# Altium schematic sheet rs485.SchDoc
size A4; SheetNumber: 4; SheetTotal: 4
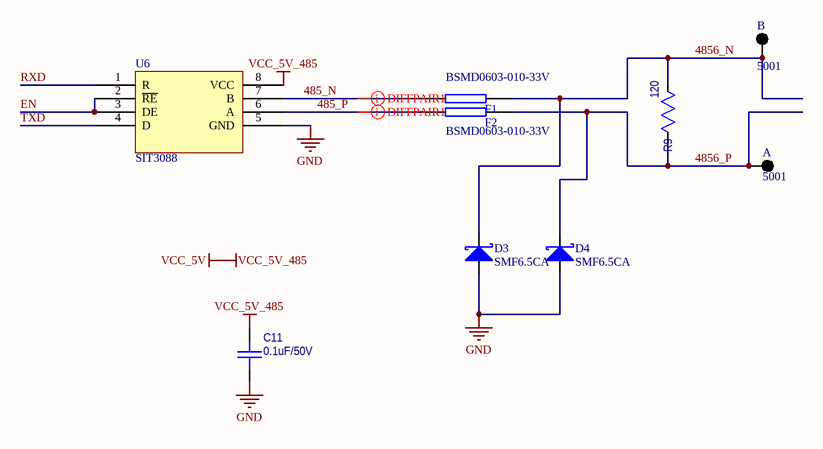
[diagram p0: rs485.SchDoc]

## Parts
A  5001  [KSTN-5001]  (no BOM)
B  5001  [KSTN-5001]  (no BOM)
C11  0.1uF/50V  [CAPC1608X092N_0603]
D3  SMF6.5CA  [SOD123]
D4  SMF6.5CA  [SOD123]
F1  BSMD0603-010-33V  [0603R]
F2  BSMD0603-010-33V  [0603R]
R9  120  [RESC1608X055N_0603]  (no BOM)
U6  SIT3088  [so-8]

## Nets
GND: C11.2 D3.1(A) D4.1(A) U6.5(GND)
VCC_5V: C11.1 U6.8(VCC)  [also labelled VCC_5V_485]
485_N: F1.2 U6.7(B)
485_P: F2.2 U6.6(A)
4856_N: B.1 D3.2(K) F1.1 R9.1
4856_P: A.1 D4.2(K) F2.1 R9.2
EN: U6.2(~{RE}) U6.3(DE)
RXD: U6.1(R)
TXD: U6.4(D)

## Layout directives
differential pair: 485_N, 485_P

## Library data of the parts
A B = 5001: Test Point, Black, 1-Pin THD, RoHS, Bulk; Manufacturer: Keystone; Value: 5001
C11 = Capacitor_0603: Capacitor, MLCC; Manufacturer: KEMET; PartNumber: C0603C104M5RACTU; Tolerance: [tol]; TempCo: [tempco]; Voltage Rating: [voltage]; ComponentLink1URL: *; Current Rating: *; ComponentLink1Description: Datasheet; Power Rating: *; Package: 0603; Value: 0.1uF/50V; SupplierDescription: CAP CER 0.1UF 50V X7R 0603
D3 D4 = DIODE S: Value: SMF6.5CA
F1 F2 = RES2: Value: BSMD0603-010-33V
R9 = Resistor_0603: Resistor, Standard; Manufacturer: Yageo; PartNumber: RC0603FR-1075KL; Power Rating: [power]; TempCo: [tempco]; Tolerance: tol; ComponentLink1URL: *; ComponentLink1Description: Datasheet; Package: 0603; Value: 120; SupplierDescription: RES SMD 75K OHM 1% 1/10W 0603
U6 = SN65HVD06D: Value: SIT3088